# Altium project LaunchyFC.PrjPcb
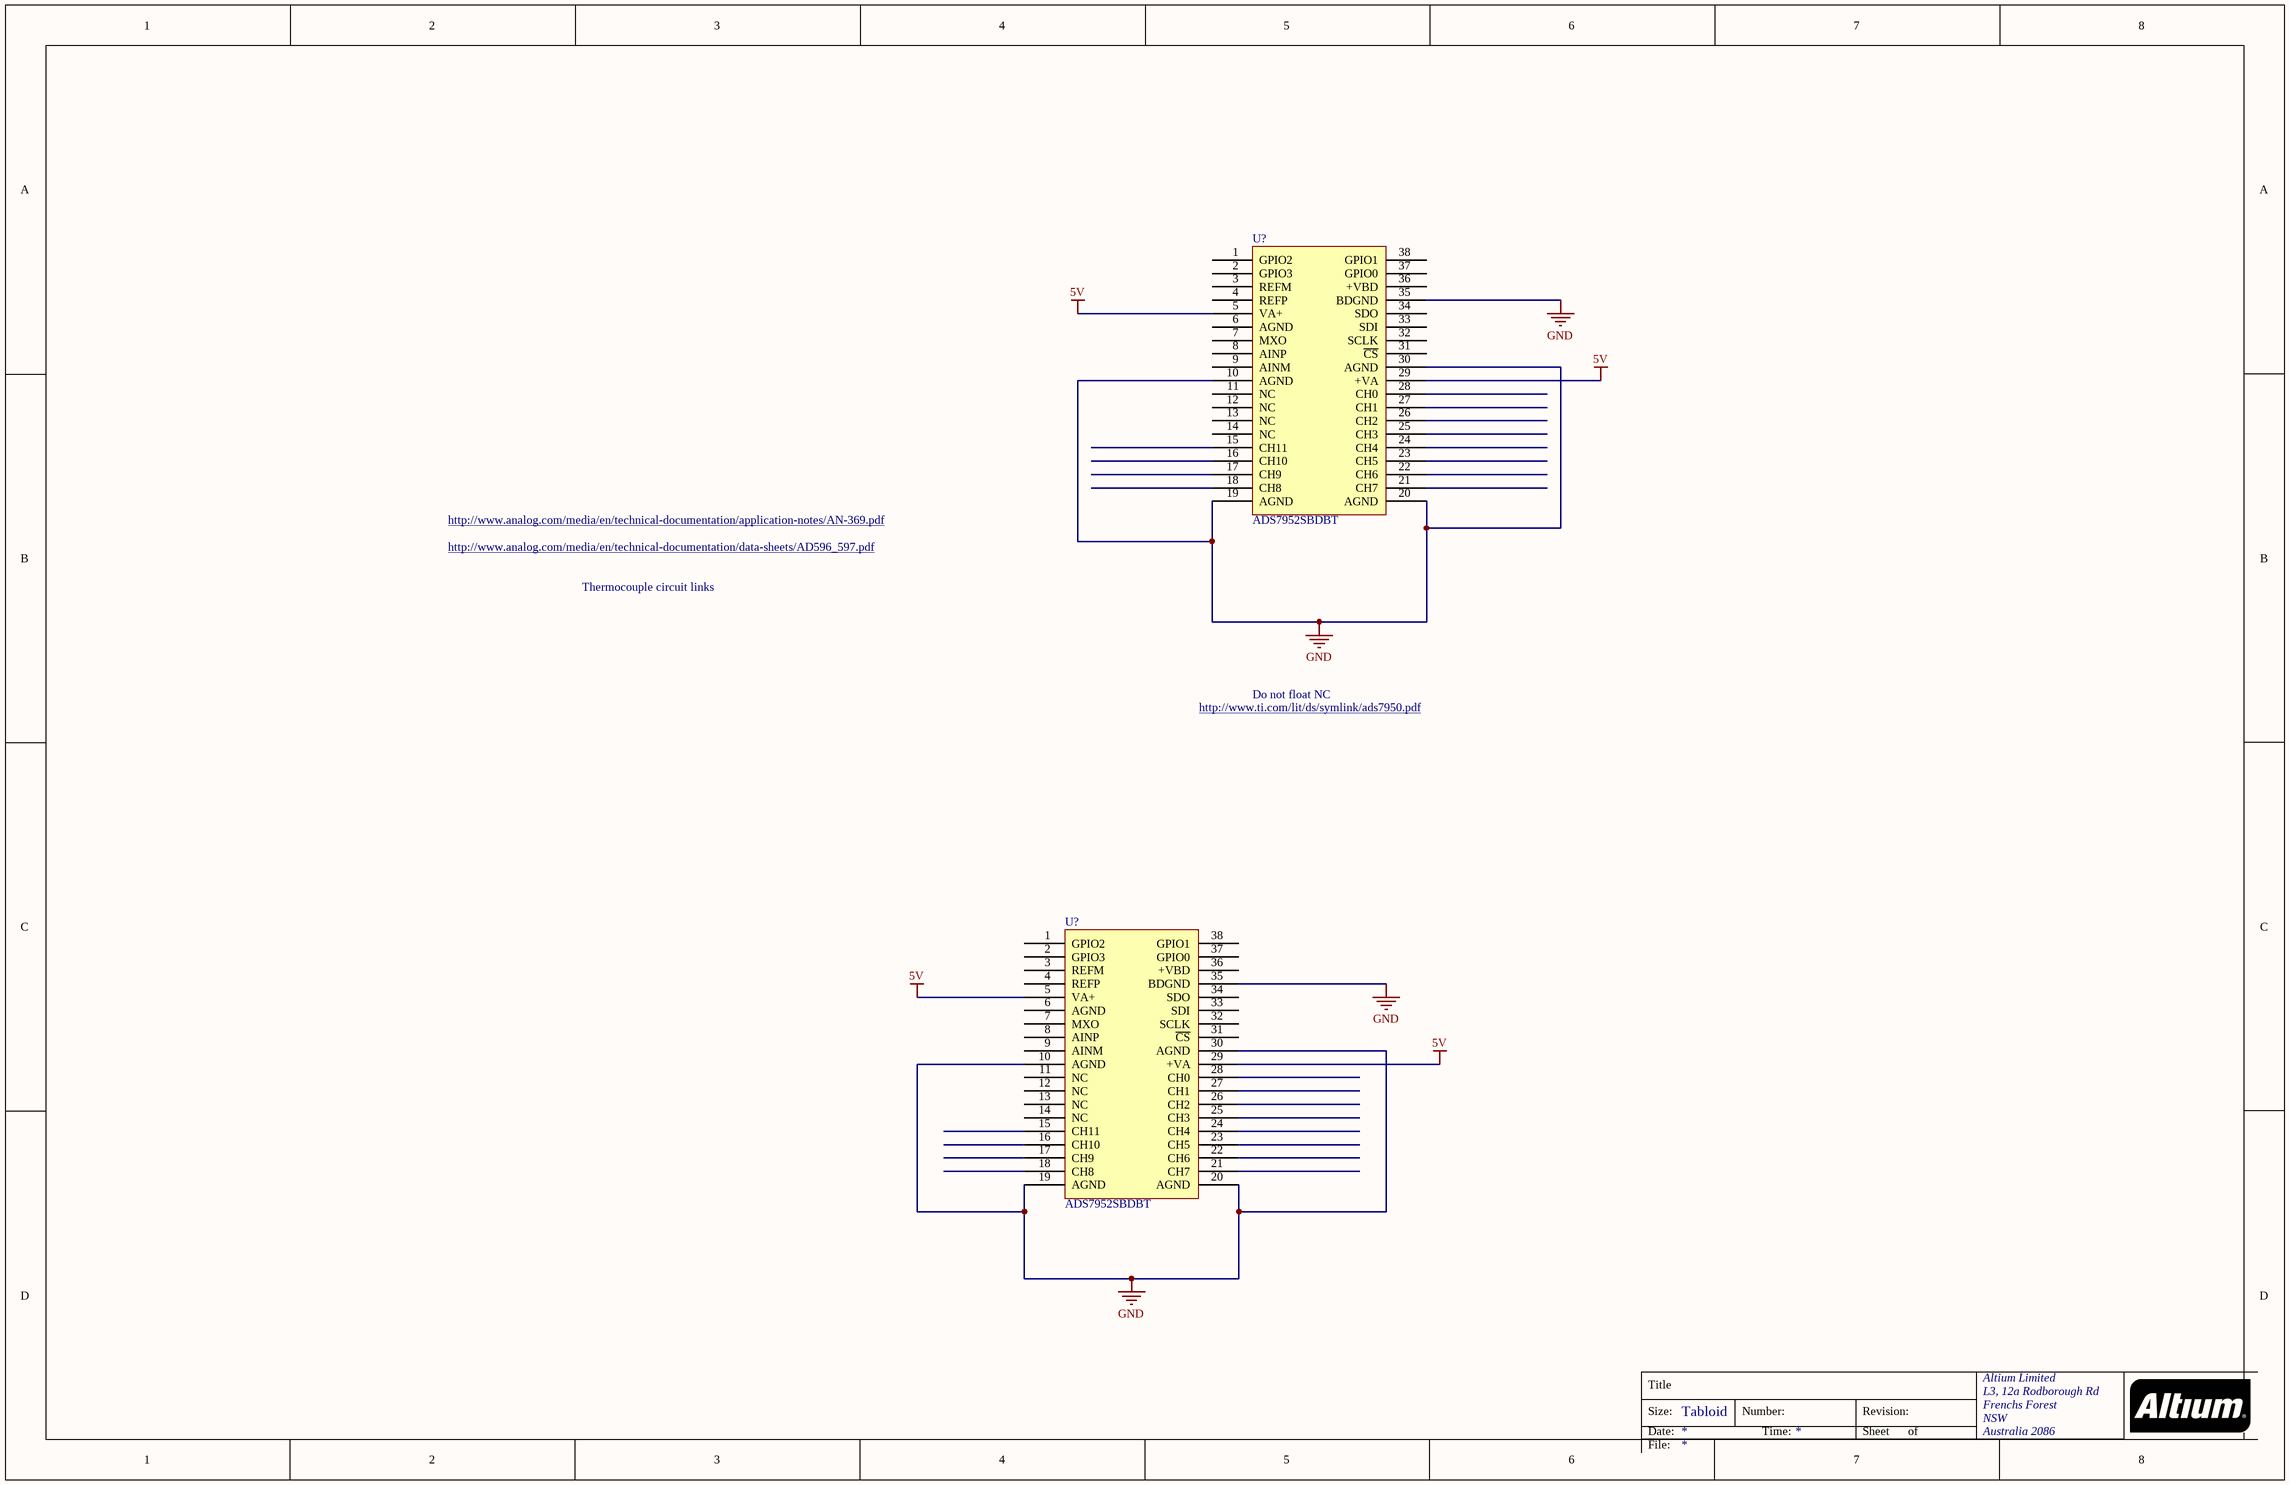
[diagram p0: ADC.SchDoc]
5 sheets, 33 parts. Net scope: flat (ports and power ports of the same name join across sheets).
Board file: LaunchyFC.PcbDoc
Sheets:
  ADC.SchDoc
  ThermocoupleCircuit.SchDoc
  power.SchDoc
  main.SchDoc
  Connectors.SchDoc

## Sheet ADC.SchDoc
size Tabloid; Organization: Altium Limited; Address1: L3, 12a Rodborough Rd; Address2: Frenchs Forest; Address3: NSW; Address4: Australia 2086

### Parts
(Parts that share a designator on the sheet are numbered #1, #2 ... from top to bottom, then left to right.)
U?#1  Manufacturer P/N: ADS7952SBDBT  [TSSOP50P640X120-38N]  (hidden comment: ADS7952)
U?#2  Manufacturer P/N: ADS7952SBDBT  [TSSOP50P640X120-38N]  (hidden comment: ADS7952)

### Nets
5V: U?#1.5(VA+) U?#1.29(+VA) U?#2.5(VA+) U?#2.29(+VA)
GND: U?#1.10(AGND) U?#1.19(AGND) U?#1.20(AGND) U?#1.30(AGND) U?#1.35(BDGND) U?#2.10(AGND) U?#2.19(AGND) U?#2.20(AGND) U?#2.30(AGND) U?#2.35(BDGND)  [project net ALU_W1]

Not connected (* = marked no-connect by the designer): U?#1 1(GPIO2) 2(GPIO3) 3(REFM) 4(REFP) 6(AGND) 7(MXO) 8(AINP) 9(AINM) 11(NC) 12(NC) 13(NC) 14(NC) 15(CH11) 16(CH10) 17(CH9) 18(CH8) 21(CH7) 22(CH6) 23(CH5) 24(CH4) 25(CH3) 26(CH2) 27(CH1) 28(CH0) 31(~{CS}) 32(SCLK) 33(SDI) 34(SDO) 36(+VBD) 37(GPIO0) 38(GPIO1); U?#2 1(GPIO2) 2(GPIO3) 3(REFM) 4(REFP) 6(AGND) 7(MXO) 8(AINP) 9(AINM) 11(NC) 12(NC) 13(NC) 14(NC) 15(CH11) 16(CH10) 17(CH9) 18(CH8) 21(CH7) 22(CH6) 23(CH5) 24(CH4) 25(CH3) 26(CH2) 27(CH1) 28(CH0) 31(~{CS}) 32(SCLK) 33(SDI) 34(SDO) 36(+VBD) 37(GPIO0) 38(GPIO1)

### Notes on the sheet
- http://www.analog.com/media/en/technical-documentation/application-notes/AN-369.pdf
- http://www.analog.com/media/en/technical-documentation/data-sheets/AD596_597.pdf
- Thermocouple circuit links
- Do not float NC
- http://www.ti.com/lit/ds/symlink/ads7950.pdf
- Title
- Size:
- Date:
- Tabloid
- Number:
- Time:
- Revision:
- Sheet
- of
- File:

### Library data of the parts
U?#1 U?#2 = ADS7952: ADC; Manufacturer: Texas Instrument; Package: TSSOP-38; Digikey P/N: 296-23502-5-ND

## Sheet ThermocoupleCircuit.SchDoc: Set in Document Options » Parameters » Title
size Tabloid; Author: Set in Document Options » Parameters » Author + Contact info
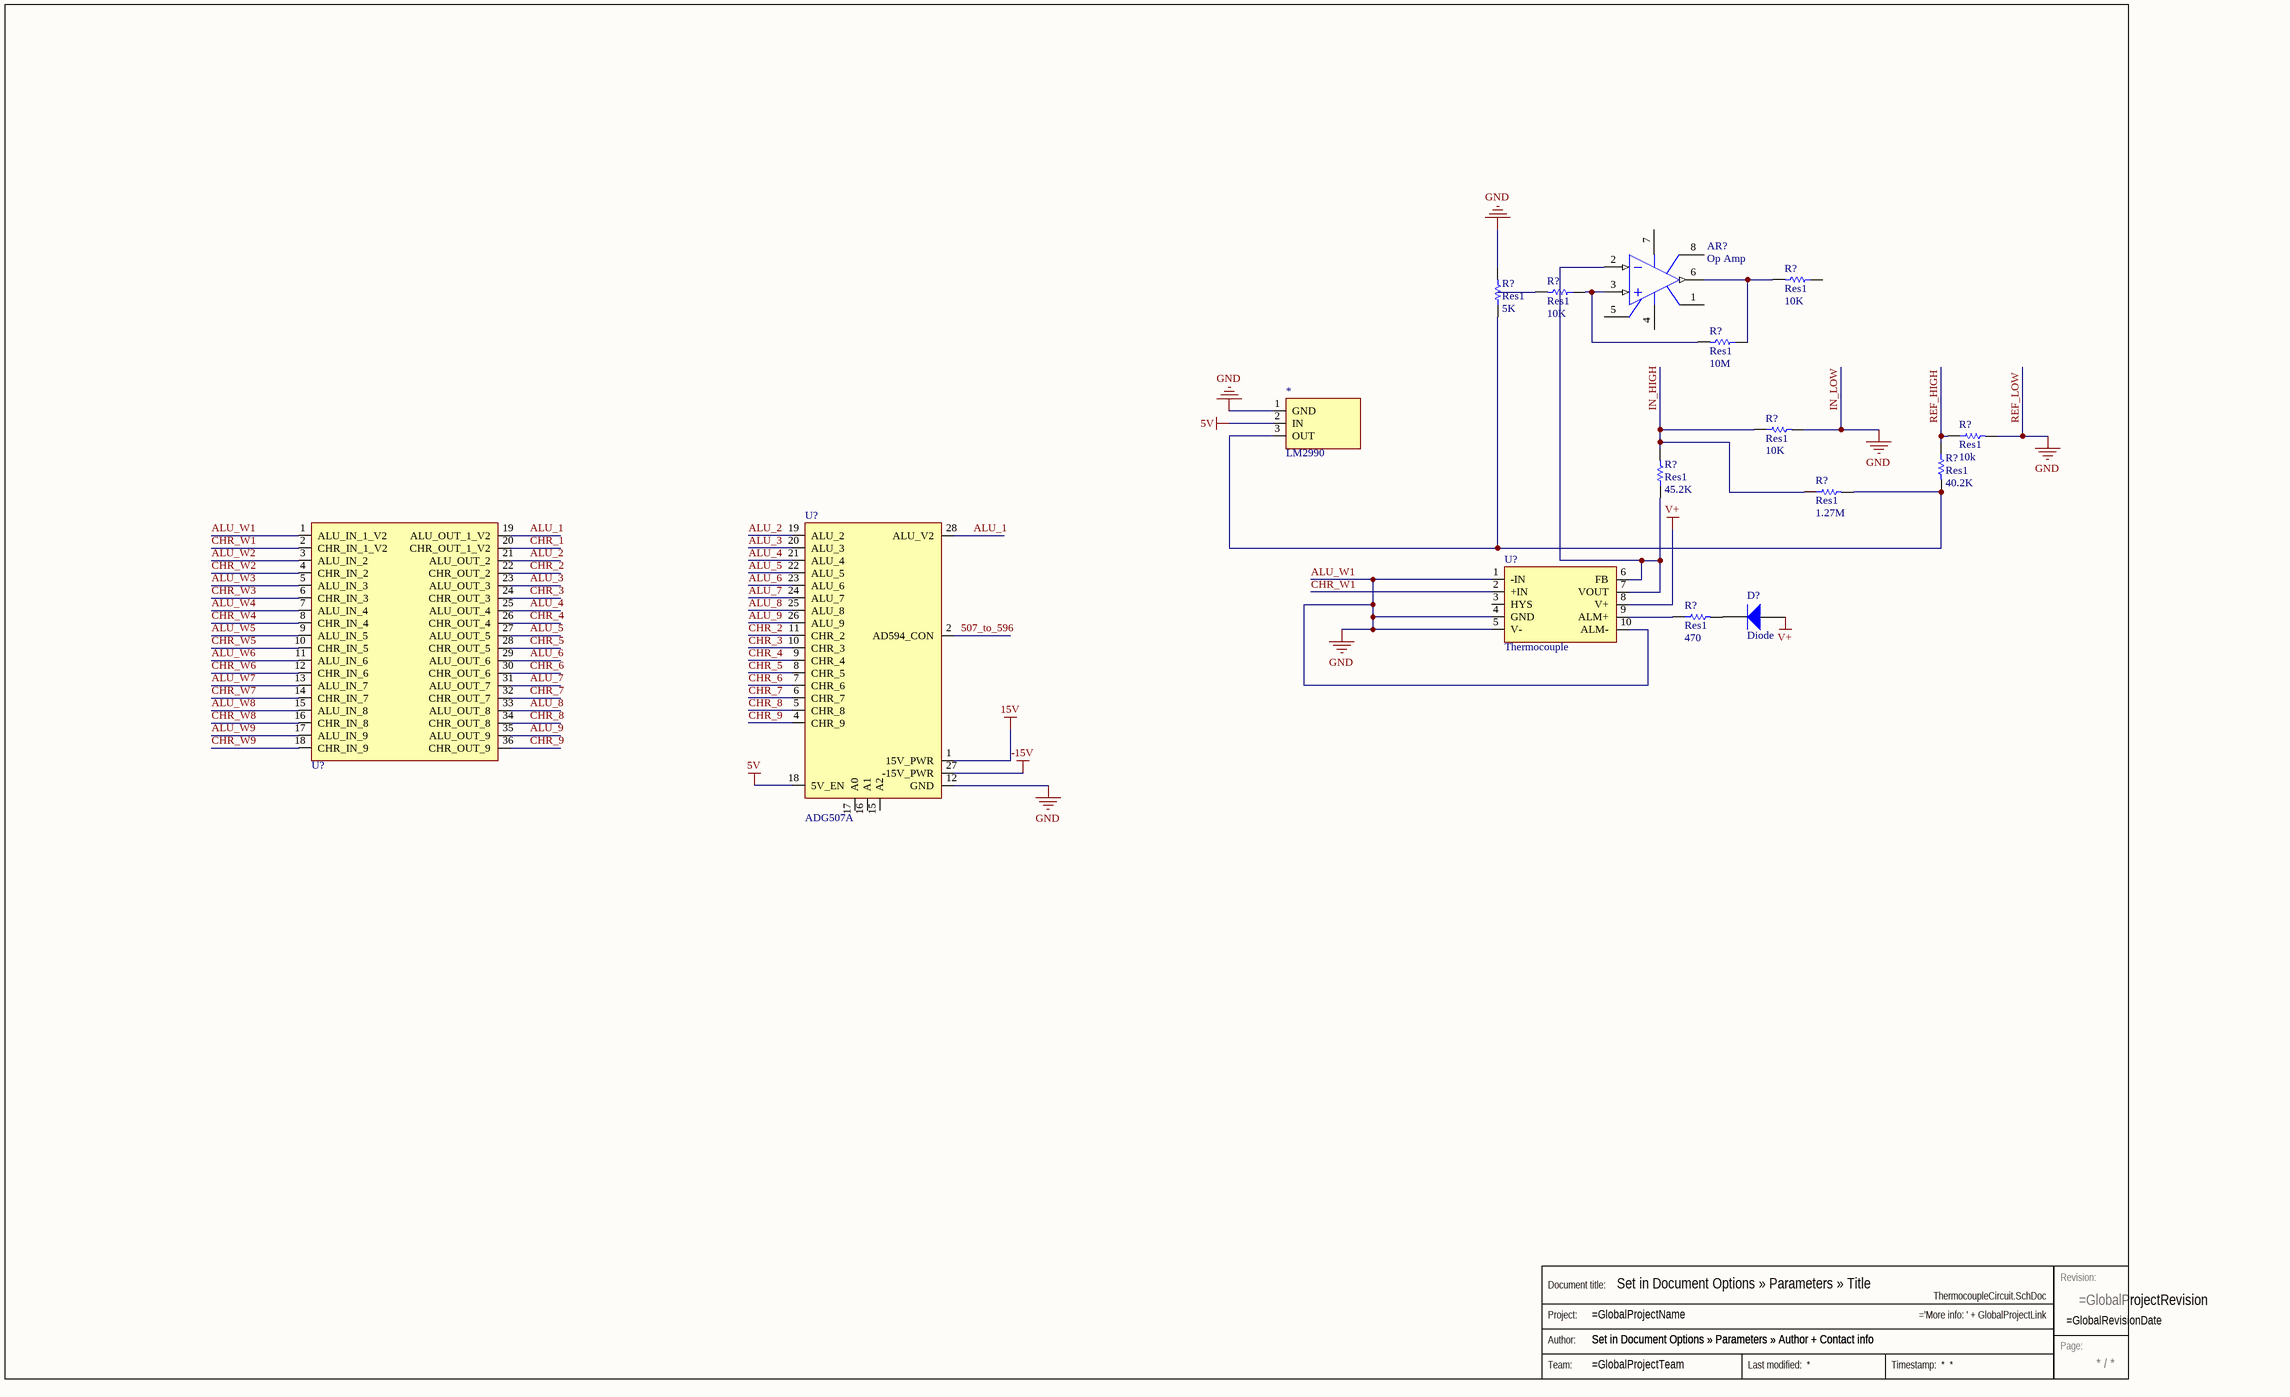
[diagram p1: ThermocoupleCircuit.SchDoc]

### Parts
(Parts that share a designator on the sheet are numbered #1, #2 ... from top to bottom, then left to right.)
*  LM2990  [LM2990]
AR?  Op Amp  [H-08A]
D?  Diode  [SMC]
R?#1  Res1  value 10K  [AXIAL-0.3]
R?#2  Res1  value 5K  [AXIAL-0.3]
R?#3  Res1  value 10K  [AXIAL-0.3]
R?#4  Res1  value 10M  [AXIAL-0.3]
R?#5  Res1  value 10K  [AXIAL-0.3]
R?#6  Res1  value 10k  [AXIAL-0.3]
R?#7  Res1  value 40.2K  [AXIAL-0.3]
R?#8  Res1  value 1.27M  [AXIAL-0.3]
R?#9  Res1  value 45.2K  [AXIAL-0.3]
R?#10  Res1  value 470  [AXIAL-0.3]
Stamp  Stamp  (value not drawn)  (graphical)
U?#3  ADG507A  [ADG507a]
U?#4  Thermocouple  [SOIC127P600X175-8N]
U?#5  Isothermal Block  (value not drawn)

### Nets
5V: *.2(IN) U?#3.18(5V_EN)
15V: U?#3.1(15V_PWR)
-15V: U?#3.27(-15V_PWR)
ALU_W1: *.1(GND) R?#2.2 R?#5.2 R?#6.2 U?#3.12(GND) U?#4.1(-IN) U?#4.4(GND) U?#4.5(V-) U?#4.10(ALM-) U?#5.1(ALU_IN_1_V2)  [also labelled GND, IN_LOW, REF_LOW]
V+: D?.1(A) U?#4.8(V+)
507_to_596: U?#3.2(AD594_CON)
ALU_1: U?#3.28(ALU_V2) U?#5.19(ALU_OUT_1_V2)
ALU_2: U?#3.19(ALU_2) U?#5.21(ALU_OUT_2)
ALU_3: U?#3.20(ALU_3) U?#5.23(ALU_OUT_3)
ALU_4: U?#3.21(ALU_4) U?#5.25(ALU_OUT_4)
ALU_5: U?#3.22(ALU_5) U?#5.27(ALU_OUT_5)
ALU_6: U?#3.23(ALU_6) U?#5.29(ALU_OUT_6)
ALU_7: U?#3.24(ALU_7) U?#5.31(ALU_OUT_7)
ALU_8: U?#3.25(ALU_8) U?#5.33(ALU_OUT_8)
ALU_9: U?#3.26(ALU_9) U?#5.35(ALU_OUT_9)
ALU_W2: U?#5.3(ALU_IN_2)
ALU_W3: U?#5.5(ALU_IN_3)
ALU_W4: U?#5.7(ALU_IN_4)
ALU_W5: U?#5.9(ALU_IN_5)
ALU_W6: U?#5.11(ALU_IN_6)
ALU_W7: U?#5.13(ALU_IN_7)
ALU_W8: U?#5.15(ALU_IN_8)
ALU_W9: U?#5.17(ALU_IN_9)
CHR_1: U?#5.20(CHR_OUT_1_V2)
CHR_2: U?#3.11(CHR_2) U?#5.22(CHR_OUT_2)
CHR_3: U?#3.10(CHR_3) U?#5.24(CHR_OUT_3)
CHR_4: U?#3.9(CHR_4) U?#5.26(CHR_OUT_4)
CHR_5: U?#3.8(CHR_5) U?#5.28(CHR_OUT_5)
CHR_6: U?#3.7(CHR_6) U?#5.30(CHR_OUT_6)
CHR_7: U?#3.6(CHR_7) U?#5.32(CHR_OUT_7)
CHR_8: U?#3.5(CHR_8) U?#5.34(CHR_OUT_8)
CHR_9: U?#3.4(CHR_9) U?#5.36(CHR_OUT_9)
CHR_W1: U?#4.2(+IN) U?#5.2(CHR_IN_1_V2)
CHR_W2: U?#5.4(CHR_IN_2)
CHR_W3: U?#5.6(CHR_IN_3)
CHR_W4: U?#5.8(CHR_IN_4)
CHR_W5: U?#5.10(CHR_IN_5)
CHR_W6: U?#5.12(CHR_IN_6)
CHR_W7: U?#5.14(CHR_IN_7)
CHR_W8: U?#5.16(CHR_IN_8)
CHR_W9: U?#5.18(CHR_IN_9)
IN_HIGH: R?#5.1 R?#8.1 R?#9.2
REF_HIGH: R?#6.1 R?#7.1
Net*_3: *.3(OUT) R?#2.1 R?#7.2 R?#8.2
NetAR?_2: AR?.2(IN-) R?#9.1 U?#4.6(FB) U?#4.7(VOUT)
NetAR?_3: AR?.3(IN+) R?#3.1 R?#4.2
NetAR?_6: AR?.6(OUT) R?#1.2 R?#4.1
NetD?_2: D?.2(K) R?#10.2
NetR?#10_1: R?#10.1 U?#4.9(ALM+)

Not connected (* = marked no-connect by the designer): AR? 1(OS_NUL) 4(V-) 5(OS_NUL) 7(V+) 8(TAB); R?#1 1; R?#3 2; U?#3 15(A2) 16(A1) 17(A0); U?#4 3(HYS)

### Notes on the sheet
- (in symbol Stamp) Revision:; Document title:; Project:; Author:; Page:; Team:

### Library data of the parts
AR? = Op Amp: FET Operational Amplifier; Published: 8-Jun-2000; LatestRevisionDate: 17-Jul-2002; LatestRevisionNote: Re-released for DXP Platform.; DatasheetVersion: REV. B; PackageVersion: 1990; PackageReference: H-08A; Publisher: Altium Limited; PackageDescription: Can; 8 Leads; Pin Circle Dia. 5.08 mm; Lead Dia. 0.53 mm (max); ComponentLink1Description: Manufacturer Link; ComponentLink1URL: http://www.analog.com/
D? = Diode: Default Diode; Published: 8-Jun-2000; LatestRevisionDate: 17-Jul-2002; LatestRevisionNote: Re-released for DXP Platform.; PackageVersion: Sep-1996; PackageReference: SMC; Publisher: Altium Limited; PackageDescription: DO-214-AB/SMC; 2 C-Bend Leads; Body 7.9 x 5.9 mm, inc. leads (LxW); Code_JEDEC: DO-214-AB
R?#1-R?#10 = Res1: Resistor; Published: 8-Jun-2000; LatestRevisionDate: 17-Jul-2002; LatestRevisionNote: Re-released for DXP Platform.; PackageReference: AXIAL-0.3; Publisher: Altium Limited; PackageDescription: Axial Device, Thru-Hole; 2 Leads; 0.3 in Pin Spacing
U?#3 = ADG507A: MUX Input
U?#4 = AD596/597

## Sheet power.SchDoc
size Tabloid; Organization: Altium Limited; Address1: L3, 12a Rodborough Rd; Address2: Frenchs Forest; Address3: NSW; Address4: Australia 2086
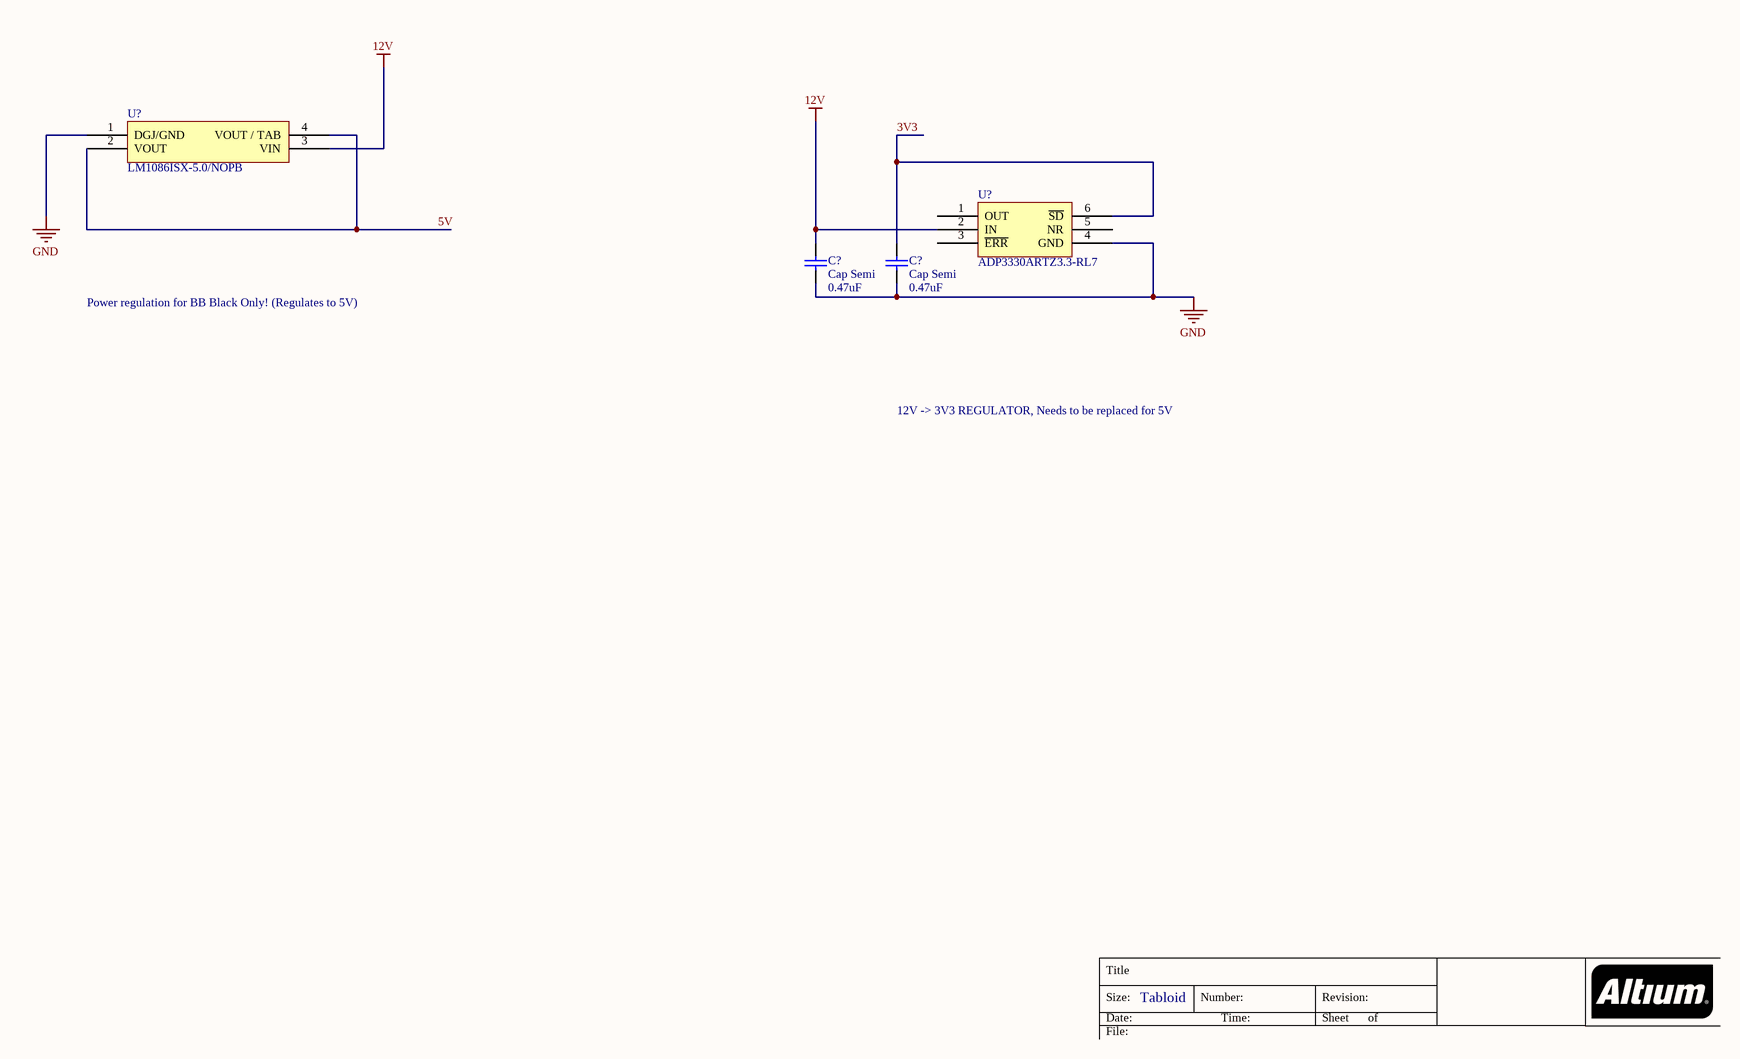
[diagram p2: power.SchDoc]

### Parts
(Parts that share a designator on the sheet are numbered #1, #2 ... from top to bottom, then left to right.)
C?#1  Cap Semi  value 0.47uF  [0402]
C?#2  Cap Semi  value 0.47uF  [0402]
U?#6  Manufacturer P/N: LM1086ISX-5.0/NOPB  [DPAK254P1430X464-4N]  (hidden comment: LM1086)
U?#7  ADP3330ARTZ3.3-RL7  [SOT95P282X145-6N]

### Nets
12V: C?#1.2 U?#6.3(VIN) U?#7.2(IN)
GND: C?#1.1 C?#2.1 U?#6.1(DGJ/GND) U?#7.4(GND)  [project net ALU_W1]
3V3: C?#2.2 U?#7.6(~{SD})
5V: U?#6.2(VOUT) U?#6.4(VOUT_/_TAB)

Not connected (* = marked no-connect by the designer): U?#7 1(OUT) 3(~{ERR}) 5(NR)

### Notes on the sheet
- Power regulation for BB Black Only! (Regulates to 5V)
- 12V -> 3V3 REGULATOR, Needs to be replaced for 5V
- Title
- Size:
- Date:
- Tabloid
- Number:
- Time:
- Revision:
- Sheet
- of
- File:

### Library data of the parts
C?#1 C?#2 = Cap Semi: Capacitor (Semiconductor SIM Model); Published: 8-Jun-2000; LatestRevisionDate: 29-May-2009; LatestRevisionNote: IPC-7351 Footprint Added.; PackageReference: C1206; Publisher: Altium Limited; PackageDescription: Chip Capacitor
U?#6 = LM1086: Voltage Regulator; Manufacturer: Texas Instruments; Digikey P/N: LM1086ISX-5.0/NOPBCT-ND
U?#7 = ADP3330ARTZ3.3-RL7: Manufacturer: Analog Devices; Digikey P/N: ADP3330ARTZ3.3-RL7DKR-ND; Digikey Link: https://www.digikey.com/product-detail/en/analog-devices-inc/ADP3330ARTZ3.3-RL7/ADP3330ARTZ3.3-RL7DKR-ND/1788602; Manufacturer P/N: ADP3330ARTZ3.3-RL7

## Sheet main.SchDoc
size Tabloid; Organization: Altium Limited; Address1: L3, 12a Rodborough Rd; Address2: Frenchs Forest; Address3: NSW; Address4: Australia 2086
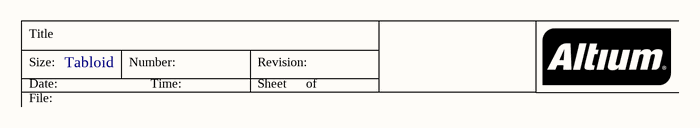
[diagram p3: main.SchDoc]

### Notes on the sheet
- Title
- Size:
- Date:
- Tabloid
- Number:
- Time:
- Revision:
- Sheet
- of
- File:

## Sheet Connectors.SchDoc
size Tabloid; Organization: Altium Limited; Address1: L3, 12a Rodborough Rd; Address2: Frenchs Forest; Address3: NSW; Address4: Australia 2086
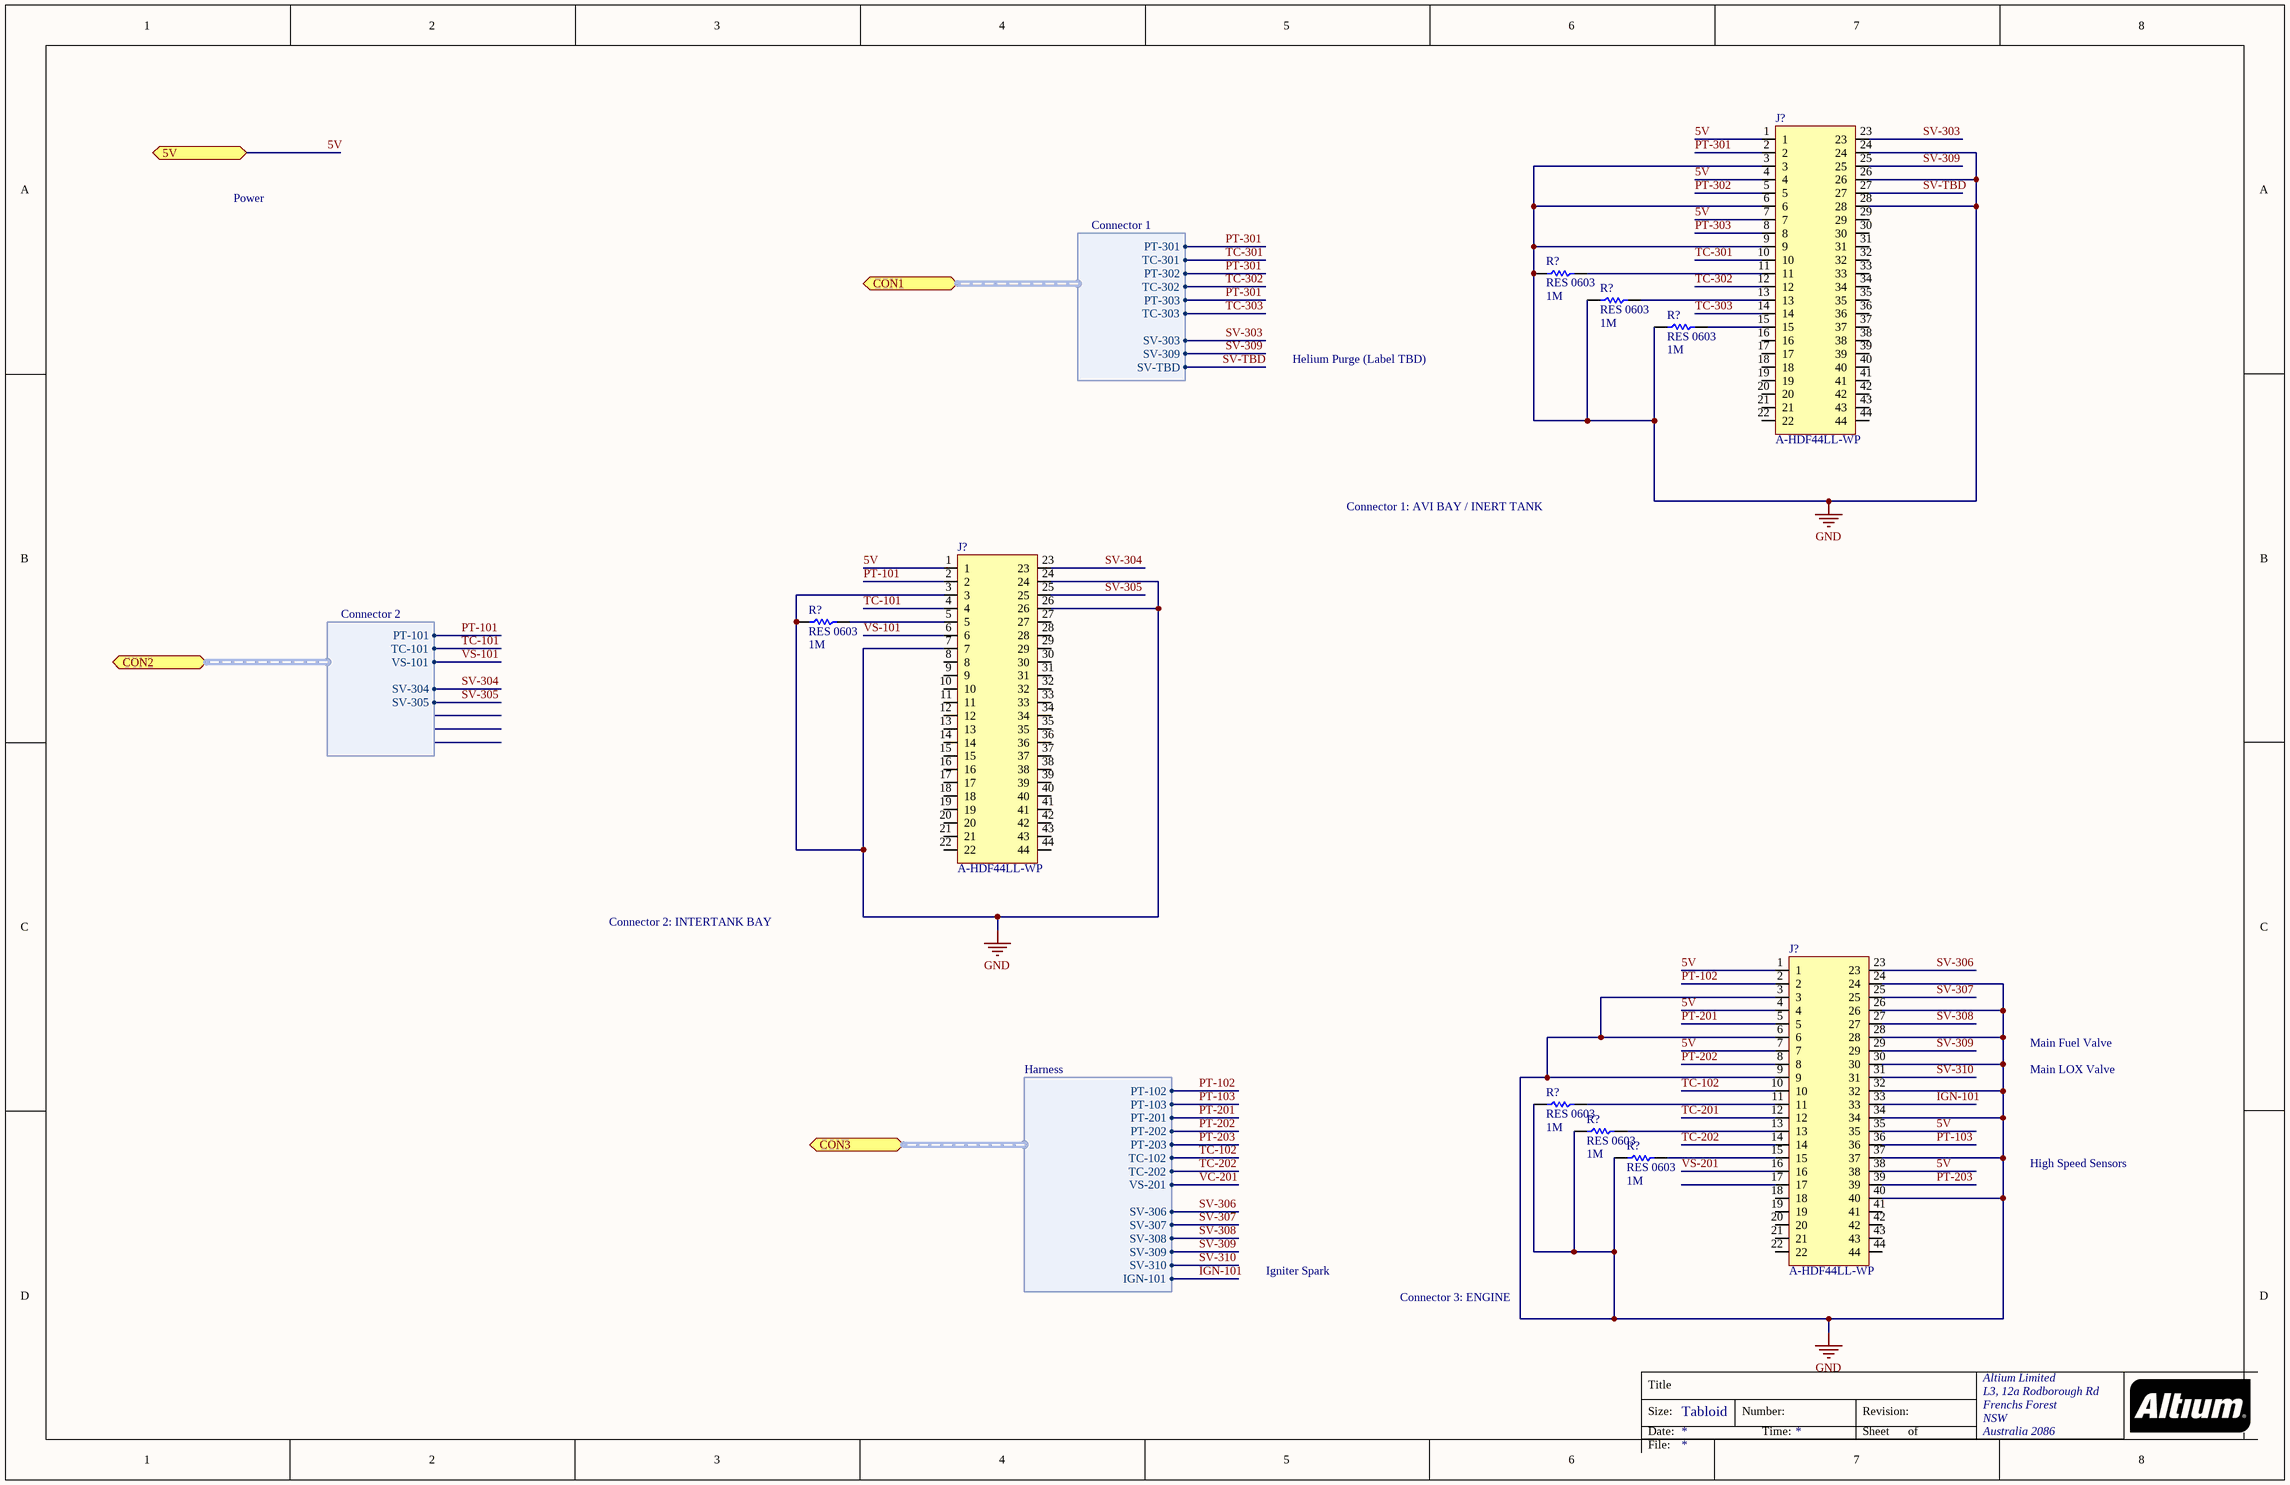
[diagram p4: Connectors.SchDoc]

### Parts
(Parts that share a designator on the sheet are numbered #1, #2 ... from top to bottom, then left to right.)
J?#1  A-HDF44LL-WP  [DSUB-44pin]
J?#2  A-HDF44LL-WP  [DSUB-44pin]
J?#3  A-HDF44LL-WP  [DSUB-44pin]
R?#11  RES 0603  Value (Ohms): 1M  [RES 0603]
R?#12  RES 0603  Value (Ohms): 1M  [RES 0603]
R?#13  RES 0603  Value (Ohms): 1M  [RES 0603]
R?#14  RES 0603  Value (Ohms): 1M  [RES 0603]
R?#15  RES 0603  Value (Ohms): 1M  [RES 0603]
R?#16  RES 0603  Value (Ohms): 1M  [RES 0603]
R?#17  RES 0603  Value (Ohms): 1M  [RES 0603]

### Ports
5V, CON1 (harness Connector 1), CON2 (harness Connector 2), CON3 (harness Harness)

### Harnesses
Connector 1: PT-301, SV-303, SV-TBD, SV-309, TC-301, TC-302, PT-302, TC-303, PT-303
Connector 2: PT-101, TC-101, SV-305, VS-101, SV-304
Harness: PT-102, PT-103, PT-201, PT-202, PT-203, TC-102, TC-202, VS-201, SV-307, SV-308, SV-306, SV-309, SV-310, IGN-101

### Nets
GND: J?#1.3 J?#1.6 J?#1.9 J?#1.24 J?#1.26 J?#1.28 J?#2.3 J?#2.7 J?#2.24 J?#2.26 J?#3.3 J?#3.6 J?#3.9 J?#3.24 J?#3.26 J?#3.28 J?#3.30 J?#3.32 J?#3.34 J?#3.37 J?#3.40 R?#11.1 R?#12.1 R?#13.1 R?#14.1 R?#15.1 R?#16.1 R?#17.1  [project net ALU_W1]
5V: J?#1.1 J?#1.4 J?#1.7 J?#2.1 J?#3.1 J?#3.4 J?#3.7 J?#3.35 J?#3.38 ; port 5V
IGN-101: J?#3.33 ; port CON3.IGN-101
PT-101: J?#2.2 ; port CON2.PT-101
PT-102: J?#3.2 ; port CON3.PT-102
PT-103: J?#3.36 ; port CON3.PT-103
PT-201: J?#3.5 ; port CON3.PT-201
PT-202: J?#3.8 ; port CON3.PT-202
PT-203: J?#3.39 ; port CON3.PT-203
PT-301: J?#1.2 ; port CON1.PT-301, port CON1.PT-302, port CON1.PT-303
PT-302: J?#1.5
PT-303: J?#1.8
SV-303: J?#1.23 ; port CON1.SV-303
SV-304: J?#2.23 ; port CON2.SV-304
SV-305: J?#2.25 ; port CON2.SV-305
SV-306: J?#3.23 ; port CON3.SV-306
SV-307: J?#3.25 ; port CON3.SV-307
SV-308: J?#3.27 ; port CON3.SV-308
SV-309: J?#1.25 J?#3.29 ; port CON1.SV-309, port CON3.SV-309
SV-310: J?#3.31 ; port CON3.SV-310
SV-TBD: J?#1.27 ; port CON1.SV-TBD
TC-101: J?#2.4 ; port CON2.TC-101
TC-102: J?#3.10 ; port CON3.TC-102
TC-201: J?#3.12
TC-202: J?#3.14 ; port CON3.TC-202
TC-301: J?#1.10 ; port CON1.TC-301
TC-302: J?#1.12 ; port CON1.TC-302
TC-303: J?#1.14 ; port CON1.TC-303
VC-201: port CON3.VS-201
VS-101: J?#2.6 ; port CON2.VS-101
VS-201: J?#3.16
NetJ?#1_11: J?#1.11 R?#11.2
NetJ?#1_13: J?#1.13 R?#12.2
NetJ?#1_15: J?#1.15 R?#13.2
NetJ?#2_5: J?#2.5 R?#14.2
NetJ?#3_11: J?#3.11 R?#15.2
NetJ?#3_13: J?#3.13 R?#16.2
NetJ?#3_15: J?#3.15 R?#17.2

Not connected (* = marked no-connect by the designer): J?#1 16 17 18 19 20 21 22 29 30 31 32 33 34 35 36 37 38 39 40 41 42 43 44; J?#2 8 9 10 11 12 13 14 15 16 17 18 19 20 21 22 27 28 29 30 31 32 33 34 35 36 37 38 39 40 41 42 43 44; J?#3 17 18 19 20 21 22 41 42 43 44

### Notes on the sheet
- Power
- Helium Purge (Label TBD)
- Connector 1: AVI BAY / INERT TANK
- Connector 2: INTERTANK BAY
- Main Fuel Valve
- Main LOX Valve
- High Speed Sensors
- Igniter Spark
- Connector 3: ENGINE
- Title
- Size:
- Date:
- Tabloid
- Number:
- Time:
- Revision:
- Sheet
- of
- File:

### Library data of the parts
J?#1-J?#3 = A-HDF44LL-WP: Connector
R?#11-R?#17 = RES 0603: PartNumber: *; Tolerance: *

## Nets that join several sheets
5V: ADC (U?#1.5 U?#1.29 U?#2.5 U?#2.29), ThermocoupleCircuit (*.2 U?#3.18)
ALU_W1: ADC (10 pins), ThermocoupleCircuit (10 pins), power (C?#1.1 C?#2.1 U?#6.1 U?#7.4), Connectors (28 pins)